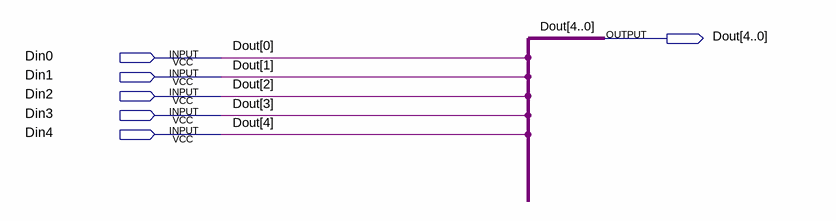
[diagram p0: schematic sheet]
// Quartus schematic cvt_1x5_5x1.bdf as structural Verilog: 0 symbols, 6 pins
module cvt_1x5_5x1 (
  input  Din0,
  input  Din1,
  input  Din2,
  input  Din3,
  input  Din4,
  output [4:0] Dout
);


  assign Dout = {Din4, Din3, Din2, Din1, Din0};
endmodule
